# Altium schematic sheet OpenPLCv0.2.0_BinaryOut.SchDoc
size 420 x 297 mm; PageSetup: Record=PageOptions|CenterHorizontal=True|CenterVertical=True|PrintScale=1.01|XCorrection=1.00|YCorrection=1.00|PrintKind=1|BorderSize=5000000|LeftOffset=0|BottomOffset=0|Orientation=2|PaperLength=1000|PaperWidth=1000|Scale=100|PaperSource=7|PrintQuality=-4|MediaType=1|DitherType=10|PaperKind=A3|PrintScaleMode=1; DocumentNumber: 11; SheetNumber: 11; SheetTotal: 22; SheetTitle: Binary Output
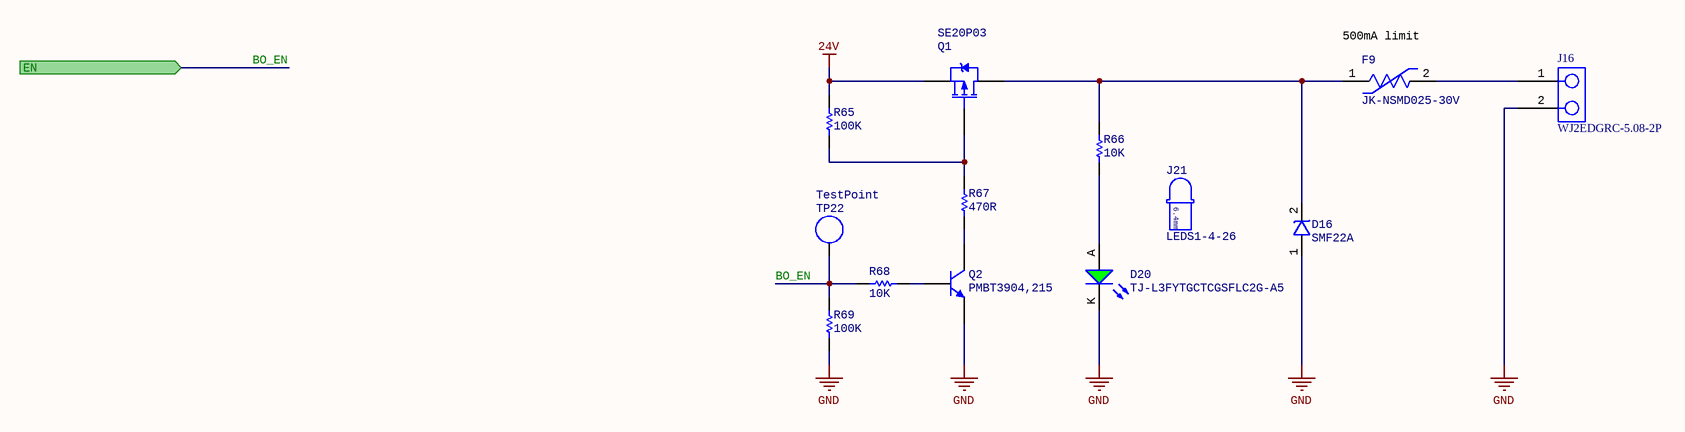
[diagram p0: OpenPLCv0.2.0_BinaryOut.SchDoc]

## Parts
D16  SMF22A  [SOD-123FL]
D20  TJ-L3FYTGCTCGSFLC2G-A5  [LED_3MM_SPACED_6.4MM_GREEN]
F9  JK-NSMD025-30V  [SMD_RES_1206(3216)_N]
J16  WJ2EDGRC-5.08-2P  [796638-2_BoardEdgeAlt]
J21  LEDS1-4-26  [3MM_LED_SPACER_6.4MM]
Q1  SE20P03  [TO-252]
Q2  PMBT3904,215  [SOT23-3]
R65  Resistance: 100K  [SMD_RES_0402(1005)_N]  (hidden comment: RC0402FR-07100KL)
R66  Resistance: 10K  [SMD_RES_0402(1005)_N]  (hidden comment: RC0402FR-0710KL)
R67  Resistance: 470R  [SMD_RES_0402(1005)_N]  (hidden comment: RC0402FR-07470RL)
R68  Resistance: 10K  [SMD_RES_0402(1005)_N]  (hidden comment: RC0402FR-0710KL)
R69  Resistance: 100K  [SMD_RES_0402(1005)_N]  (hidden comment: RC0402FR-07100KL)
TP22  TestPoint  [Pad]  (no BOM)

## Ports
EN (in)

## Nets
24V: Q1.3(S) R65.2
GND: D16.1(ANODE) D20.K J16.2 Q2.2(E) R69.2
BO_EN: R68.2 R69.1 TP22.1 ; port EN
NetD16_2: D16.2(CATHODE) F9.1 Q1.2(D) R66.2
NetD20_A: D20.A R66.1
NetF9_2: F9.2 J16.1
NetQ1_1: Q1.1(G) R65.1 R67.2
NetQ2_1: Q2.1(B) R68.1
NetQ2_3: Q2.3(C) R67.1

## Notes on the sheet
- (near F9) 500mA limit
- FILE NAME
- PROJECT
- TITLE
- REV
- AUTHOR
- SIZE
- SHEET
- DATE
- OF
- A3
- (in symbol LEDS1-4-26) 6.4mm

## Library data of the parts
D16 = SMF22A: Unidirectional 22V 24.4V 35.5V 5.6A SOD-123F TVS RoHS
D20 = TJ-L3FYTGCTCGSFLC2G-A5: LED 3mm Green 515nm~530nm 1.8V~3.6V Through Hole Light Emitting Diodes (LED) RoHS C330751
F9 = JK-NSMD025-30V: Polymeric 30V 500mA 0.08s 700mΩ 1206 PTC Resettable Fuses RoHS
J16 = WJ2EDGRC-5.08-2P: Covered（4Sided） 2 1 0.200"（5.08mm） 2 P=5.08mm Pluggable System Terminal Block RoHS
J21 = LEDS1-4-26: 3mm LED spacer 6.4mm height
Q1 = SE20P03: P-Channel 30V 19A 3V @ 250uA 50mΩ @ 10A,10V 30W TO-252-2(DPAK) MOSFET RoHS
Q2 = PMBT3904,215: NPN 200mA 40V 250mW SOT-23(SOT-23-3) Transistors (NPN/PNP) RoHS
R65 R69 = 100K 0402 1% 1/16W: 100kΩ ±1% 1/16W ±100ppm/℃ 0402 Chip Resistor - Surface Mount RoHS; Package: 0402; Tolerance: 1%; Power Rating: 1/16W
R66 R68 = 10K 0402 1% 1/16W: 10kΩ ±1% 1/16W ±100ppm/℃ 0402 Chip Resistor - Surface Mount RoHS; Package: 0402; Tolerance: 1%; Power Rating: 1/16W
R67 = 470R 0402 1% 1W: 470Ω ±1% 1/16W ±100ppm/℃ 0402 Chip Resistor - Surface Mount RoHS; Power Rating: 1W; Package: 0402; Tolerance: 1%
TP22 = Test point